# Altium schematic sheet Oscillator_16MHz.SchDoc: Oscillator 16MHz
size A4
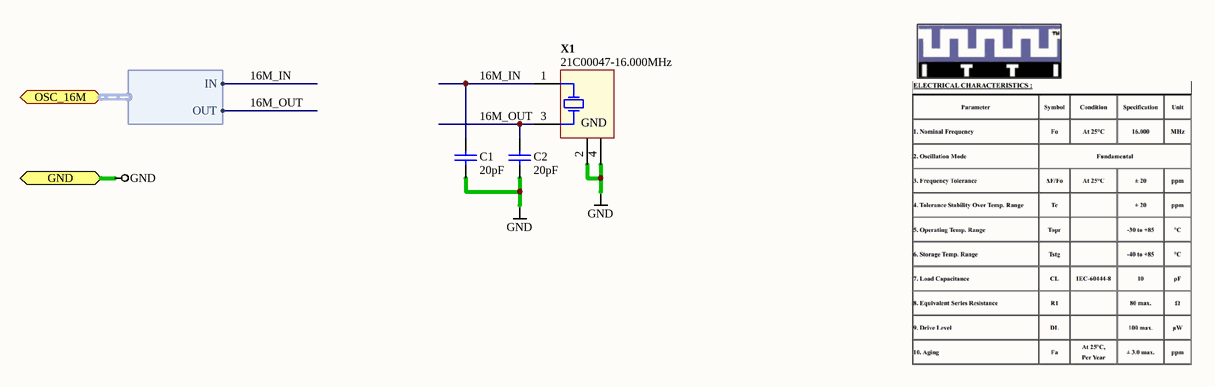
[diagram p0: Oscillator_16MHz.SchDoc]

## Parts
C1  value 20pF  [CAPC0402(1005)60_N]  (hidden comment: CAP 20pF 10V 0402(1005))
C2  value 20pF  [CAPC0402(1005)60_N]  (hidden comment: CAP 20pF 10V 0402(1005))
X1  21C00047-16.000MHz  [ITTI-21C00047-16.000MHz-4_V]

## Ports
GND, OSC_16M (harness OSC)

## Harnesses
OSC: OUT, IN

## Nets
GND: C1.2 C2.2 X1.2(GND) X1.4(GND) ; port GND
16M_IN: C1.1 X1.1(XTAL) ; port OSC_16M.IN
16M_OUT: C2.1 X1.3(XTAL) ; port OSC_16M.OUT

## Notes on the sheet
- Sheet Title
- Project Title
- Size:
- Date:
- A4
- Item:
- Time:
- Revision:
- Sheet
- of
- File:

## Library data of the parts
C1 C2 = CMP-1034-00871-1: CAP 20pF 10V ±0.25pF 0402 (1005 Metric) Thickness 0.6mm SMD; Case-Metric: 1005; Case-EIA: 0402; Rated Voltage: 10 V; Max Thickness: 0.6 mm; Tolerance: ±0.25pF; Technology: SMT
X1 = CMP-0464-00001-1: Crystal, 16 MHz, -30 to 85 degC, 3.2 x 2.5 x 0.9 mm SMD; Manufacturer: ITTI; Nominal Frequency: 16 MHz; Overtone Order: Fundamental; Drive Level: 100 max. uw; Load Capacitance: 10 pF; Frequency Tolerance: +/-20 ppm; Mounting Technology: Surface Mount; ComponentLink1URL: http://www.itti-co.com; Operating Temperature: -30 to 85 degC; PartNumber: 21C00047-16.000MHz; PackageDescription: 4-Pin Hand Drawn, Body 3.2 x 2.5mm; ComponentLink1Description: Manufacturer URL; PackageReference: 21C00047-16.000MHz-4